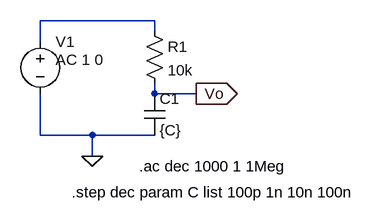
[diagram p0: schematic q3.asc]
q3.asc, the LTspice schematic file:
Version 4
SHEET 1 880 680
WIRE 208 48 32 48
WIRE 208 64 208 48
WIRE 32 80 32 48
WIRE 208 160 208 144
WIRE 272 160 208 160
WIRE 32 224 32 160
WIRE 112 224 32 224
WIRE 208 224 112 224
WIRE 112 256 112 224
FLAG 112 256 0
FLAG 272 160 Vo
IOPIN 272 160 Out
SYMBOL res 192 48 R0
SYMATTR InstName R1
SYMATTR Value 10k
SYMBOL cap 192 160 R0
SYMATTR InstName C1
SYMATTR Value {C}
SYMBOL voltage 32 64 R0
WINDOW 123 24 44 Left 2
WINDOW 39 0 0 Left 0
SYMATTR Value2 AC 1 0
SYMATTR InstName V1
SYMATTR Value ""
TEXT 184 272 Left 2 !.ac dec 1000 1 1Meg
TEXT 80 312 Left 2 !.step dec param C list 100p 1n 10n 100n

The netlist it stands for:
* q3.asc
R1 N001 Vo 10k
C1 Vo 0 {C}
V1 N001 0 AC 1 0
.ac dec 1000 1 1Meg
.step dec param C list 100p 1n 10n 100n
.backanno
.end